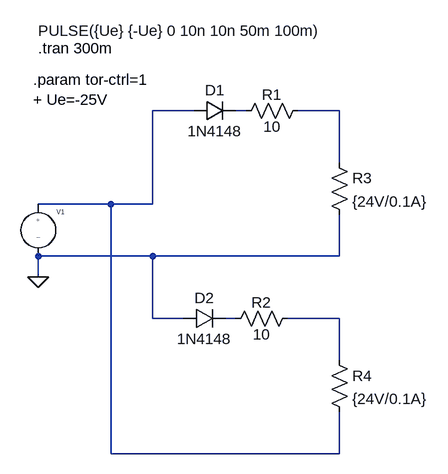
[diagram p0: schematic tor-ctrl_v1.asc]
tor-ctrl_v1.asc, the LTspice schematic file:
Version 4
SHEET 1 920 680
WIRE 288 16 224 16
WIRE 368 16 352 16
WIRE 512 16 448 16
WIRE 512 96 512 16
WIRE 160 160 48 160
WIRE 224 160 224 16
WIRE 224 160 160 160
WIRE 224 240 48 240
WIRE 512 240 512 176
WIRE 512 240 224 240
WIRE 48 272 48 240
WIRE 224 336 224 240
WIRE 272 336 224 336
WIRE 352 336 336 336
WIRE 512 336 432 336
WIRE 512 400 512 336
WIRE 160 544 160 160
WIRE 512 544 512 480
WIRE 512 544 160 544
FLAG 48 272 0
DATAFLAG 592 368 "I(R4)"
DATAFLAG 592 80 "I(R3)"
SYMBOL MDB_sym\\source-V 48 144 R0
WINDOW 3 0 -251 Left 2
WINDOW 123 0 0 Left 2
WINDOW 39 0 0 Left 2
SYMATTR InstName V1
SYMATTR Value PULSE({Ue} {-Ue} 0 10n 10n 50m 100m)
SYMBOL diode 288 32 R270
WINDOW 0 32 32 VTop 2
WINDOW 3 0 32 VBottom 2
SYMATTR InstName D1
SYMATTR Value 1N4148
SYMBOL diode 272 352 R270
WINDOW 0 32 32 VTop 2
WINDOW 3 0 32 VBottom 2
SYMATTR InstName D2
SYMATTR Value 1N4148
SYMBOL res 352 32 R270
WINDOW 0 25 56 VTop 2
WINDOW 3 7 56 VBottom 2
SYMATTR InstName R1
SYMATTR Value 10
SYMBOL res 336 352 R270
WINDOW 0 25 56 VTop 2
WINDOW 3 7 56 VBottom 2
SYMATTR InstName R2
SYMATTR Value 10
SYMBOL res 496 384 R0
SYMATTR InstName R4
SYMATTR Value {24V/0.1A}
SYMBOL res 496 80 R0
SYMATTR InstName R3
SYMATTR Value {24V/0.1A}
TEXT 48 -80 Left 2 !.tran 300m
TEXT 40 -32 Left 2 !.param tor-ctrl=1\n+ Ue=-25V

The netlist it stands for:
* tor-ctrl_v1.asc
V1 N001 0 PULSE({Ue} {-Ue} 0 10n 10n 50m 100m)
D1 N001 N002 1N4148
D2 0 N004 1N4148
R1 N002 N003 10
R2 N004 N005 10
R4 N005 N001 {24V/0.1A}
R3 N003 0 {24V/0.1A}
.model D D
.lib standard.dio
.tran 300m
.param tor-ctrl=1
+ Ue=-25V
.backanno
.end